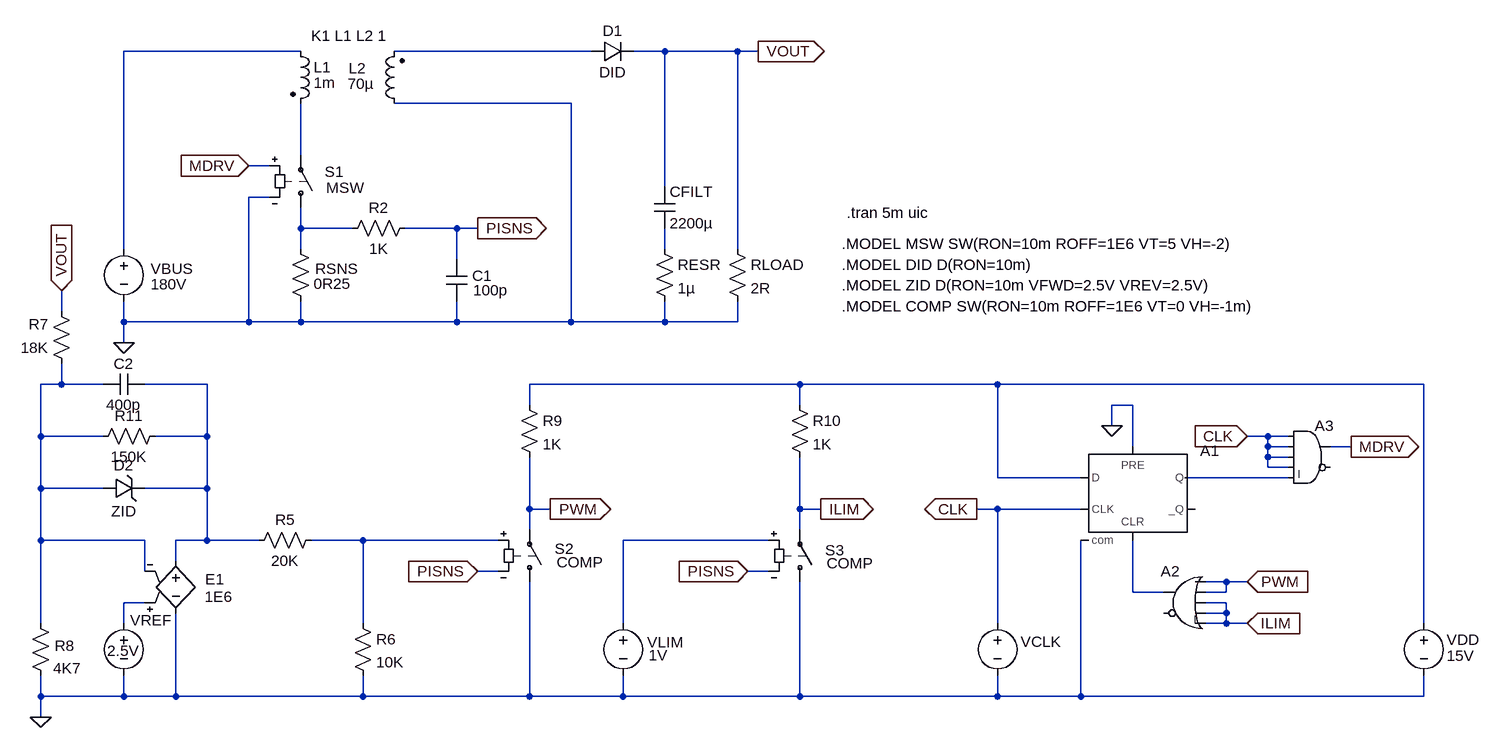
[diagram p0: schematic flyback.asc]
flyback.asc, the LTspice schematic file:
Version 4
SHEET 1 2300 1304
WIRE 368 96 96 96
WIRE 816 96 512 96
WIRE 928 96 880 96
WIRE 1040 96 928 96
WIRE 1072 96 1040 96
WIRE 784 176 512 176
WIRE 368 256 368 176
WIRE 320 272 288 272
WIRE 928 304 928 96
WIRE 320 320 288 320
WIRE 368 368 368 336
WIRE 448 368 368 368
WIRE 608 368 528 368
WIRE 640 368 608 368
WIRE 96 400 96 96
WIRE 368 400 368 368
WIRE 928 400 928 368
WIRE 1040 400 1040 96
WIRE 608 416 608 368
WIRE 0 496 0 464
WIRE 96 512 96 480
WIRE 288 512 288 320
WIRE 288 512 96 512
WIRE 368 512 368 480
WIRE 368 512 288 512
WIRE 608 512 608 480
WIRE 608 512 368 512
WIRE 784 512 784 176
WIRE 784 512 608 512
WIRE 928 512 928 480
WIRE 928 512 784 512
WIRE 1040 512 1040 480
WIRE 1040 512 928 512
WIRE 96 544 96 512
WIRE 0 608 0 576
WIRE 0 608 -32 608
WIRE 64 608 0 608
WIRE 224 608 128 608
WIRE 1136 608 720 608
WIRE 1440 608 1136 608
WIRE 2096 608 1440 608
WIRE 720 640 720 608
WIRE 1136 640 1136 608
WIRE 1648 640 1616 640
WIRE 1616 672 1616 640
WIRE -32 688 -32 608
WIRE 64 688 -32 688
WIRE 224 688 224 608
WIRE 224 688 144 688
WIRE 1856 688 1824 688
WIRE 1888 688 1856 688
WIRE 1648 704 1648 640
WIRE 1856 704 1856 688
WIRE 1888 704 1856 704
WIRE 1984 704 1952 704
WIRE 1856 720 1856 704
WIRE 1888 720 1856 720
WIRE 1856 736 1856 720
WIRE 1888 736 1856 736
WIRE 1440 752 1440 608
WIRE 1568 752 1440 752
WIRE 1888 752 1728 752
WIRE -32 768 -32 688
WIRE 64 768 -32 768
WIRE 224 768 224 688
WIRE 224 768 128 768
WIRE 720 800 720 720
WIRE 752 800 720 800
WIRE 1136 800 1136 720
WIRE 1168 800 1136 800
WIRE 1440 800 1408 800
WIRE 1568 800 1440 800
WIRE 720 832 720 800
WIRE 1136 832 1136 800
WIRE -32 848 -32 768
WIRE 128 848 -32 848
WIRE 224 848 224 768
WIRE 224 848 176 848
WIRE 304 848 224 848
WIRE 464 848 384 848
WIRE 672 848 464 848
WIRE 1088 848 864 848
WIRE 176 880 176 848
WIRE 128 896 128 848
WIRE 672 896 640 896
WIRE 1088 896 1056 896
WIRE 1792 912 1760 912
WIRE 1824 912 1792 912
WIRE 1648 928 1648 848
WIRE 1696 928 1648 928
WIRE 1792 928 1792 912
WIRE 1792 928 1760 928
WIRE 128 944 96 944
WIRE 1792 944 1760 944
WIRE 1792 960 1792 944
WIRE 1792 960 1760 960
WIRE -32 976 -32 848
WIRE 96 976 96 944
WIRE 464 976 464 848
WIRE 864 976 864 848
WIRE 1440 976 1440 800
WIRE 1792 976 1792 960
WIRE 1792 976 1760 976
WIRE 1824 976 1792 976
WIRE 2096 976 2096 608
WIRE -32 1088 -32 1056
WIRE 96 1088 96 1056
WIRE 96 1088 -32 1088
WIRE 176 1088 176 960
WIRE 176 1088 96 1088
WIRE 464 1088 464 1056
WIRE 464 1088 176 1088
WIRE 720 1088 720 912
WIRE 720 1088 464 1088
WIRE 864 1088 864 1056
WIRE 864 1088 720 1088
WIRE 1136 1088 1136 912
WIRE 1136 1088 864 1088
WIRE 1440 1088 1440 1056
WIRE 1440 1088 1136 1088
WIRE 1568 1088 1568 848
WIRE 1568 1088 1440 1088
WIRE 2096 1088 2096 1056
WIRE 2096 1088 1568 1088
WIRE -32 1120 -32 1088
FLAG 640 368 PISNS
IOPIN 640 368 Out
FLAG 288 272 MDRV
IOPIN 288 272 In
FLAG 96 544 0
FLAG -32 1120 0
FLAG 640 896 PISNS
IOPIN 640 896 In
FLAG 1056 896 PISNS
IOPIN 1056 896 In
FLAG 0 464 VOUT
IOPIN 0 464 In
FLAG 1072 96 VOUT
IOPIN 1072 96 Out
FLAG 752 800 PWM
IOPIN 752 800 Out
FLAG 1168 800 ILIM
IOPIN 1168 800 Out
FLAG 1408 800 CLK
IOPIN 1408 800 Out
FLAG 1616 672 0
FLAG 1984 704 MDRV
IOPIN 1984 704 Out
FLAG 1824 912 PWM
IOPIN 1824 912 In
FLAG 1824 976 ILIM
IOPIN 1824 976 In
FLAG 1824 688 CLK
IOPIN 1824 688 In
SYMBOL sw 368 352 M180
WINDOW 0 37 71 Left 0
WINDOW 3 39 46 Left 0
SYMATTR InstName S1
SYMATTR Value MSW
SYMBOL ind2 352 80 R0
WINDOW 3 36 64 Left 0
SYMATTR Value 1m
SYMATTR InstName L1
SYMATTR Type ind
SYMBOL ind2 528 192 R180
WINDOW 0 59 70 Left 0
WINDOW 3 47 46 Left 0
SYMATTR InstName L2
SYMATTR Value 70µ
SYMATTR Type ind
SYMBOL res 352 384 R0
WINDOW 0 38 46 Left 0
WINDOW 3 36 69 Left 0
SYMATTR InstName RSNS
SYMATTR Value 0R25
SYMBOL res 544 352 R90
WINDOW 0 0 56 VBottom 0
WINDOW 3 32 56 VTop 0
SYMATTR InstName R2
SYMATTR Value 1K
SYMBOL cap 592 416 R0
WINDOW 0 40 25 Left 0
WINDOW 3 41 47 Left 0
SYMATTR InstName C1
SYMATTR Value 100p
SYMBOL diode 816 112 R270
WINDOW 0 32 32 VTop 0
WINDOW 3 0 32 VBottom 0
SYMATTR InstName D1
SYMATTR Value DID
SYMBOL cap 912 304 R0
SYMATTR InstName CFILT
SYMATTR Value 2200µ
SYMBOL res 912 384 R0
SYMATTR InstName RESR
SYMATTR Value 1µ
SYMBOL voltage 96 384 R0
WINDOW 0 41 46 Left 0
WINDOW 3 41 70 Left 0
SYMATTR InstName VBUS
SYMATTR Value 180V
SYMBOL res 1024 384 R0
SYMATTR InstName RLOAD
SYMATTR Value 2R
SYMBOL e2 176 864 R0
WINDOW 0 45 44 Left 0
WINDOW 3 44 71 Left 0
SYMATTR InstName E1
SYMATTR Value 1E6
SYMBOL voltage 96 960 R0
WINDOW 0 10 11 Left 0
WINDOW 3 -26 58 Left 0
SYMATTR InstName VREF
SYMATTR Value 2.5V
SYMBOL res 400 832 R90
WINDOW 0 0 56 VBottom 0
WINDOW 3 32 56 VTop 0
SYMATTR InstName R5
SYMATTR Value 20K
SYMBOL res 448 960 R0
SYMATTR InstName R6
SYMATTR Value 10K
SYMBOL sw 720 928 M180
WINDOW 0 39 67 Left 0
WINDOW 3 42 46 Left 0
SYMATTR InstName S2
SYMATTR Value COMP
SYMBOL sw 1136 928 M180
WINDOW 0 39 65 Left 0
WINDOW 3 41 45 Left 0
SYMATTR InstName S3
SYMATTR Value COMP
SYMBOL voltage 864 960 R0
WINDOW 0 37 45 Left 0
WINDOW 3 39 65 Left 0
WINDOW 123 0 0 Left 0
WINDOW 39 0 0 Left 0
SYMATTR InstName VLIM
SYMATTR Value 1V
SYMBOL res 16 592 R180
WINDOW 0 36 76 Left 0
WINDOW 3 36 40 Left 0
SYMATTR InstName R7
SYMATTR Value 18K
SYMBOL res -16 1072 R180
WINDOW 0 -36 62 Left 0
WINDOW 3 -46 27 Left 0
SYMATTR InstName R8
SYMATTR Value 4K7
SYMBOL res 704 624 R0
SYMATTR InstName R9
SYMATTR Value 1K
SYMBOL res 1120 624 R0
SYMATTR InstName R10
SYMATTR Value 1K
SYMBOL Digital\\dflop 1648 704 R0
SYMATTR InstName A1
SYMATTR SpiceLine VHIGH=15 VLOW=0 TRISE=10N TFALL=10N
SYMBOL voltage 1440 960 R0
WINDOW 0 36 44 Left 0
WINDOW 3 36 63 Invisible 0
WINDOW 123 0 0 Left 0
WINDOW 39 0 0 Left 0
SYMATTR InstName VCLK
SYMATTR Value PULSE(0 15 0 10n 10n 9u 10u)
SYMBOL voltage 2096 960 R0
WINDOW 0 35 41 Left 0
WINDOW 3 35 66 Left 0
WINDOW 123 0 0 Left 0
WINDOW 39 0 0 Left 0
SYMATTR InstName VDD
SYMATTR Value 15V
SYMBOL Digital\\or 1728 880 M0
SYMATTR InstName A2
SYMATTR SpiceLine VHIGH=15 VLOW=0 TRISE=10N TFALL=10N
SYMBOL cap 128 592 R90
WINDOW 0 0 32 VBottom 0
WINDOW 3 32 32 VTop 0
SYMATTR InstName C2
SYMATTR Value 400p
SYMBOL Digital\\and 1920 656 R0
SYMATTR InstName A3
SYMATTR SpiceLine VHIGH=15 VLOW=0 TRISE=10N TFALL=10N
SYMBOL zener 64 784 R270
WINDOW 0 36 32 VTop 0
WINDOW 3 -4 32 VBottom 0
SYMATTR InstName D2
SYMATTR Value ZID
SYMBOL res 160 672 R90
WINDOW 0 0 56 VBottom 0
WINDOW 3 32 56 VTop 0
SYMATTR InstName R11
SYMATTR Value 150K
TEXT 384 72 Left 0 !K1 L1 L2 1
TEXT 1208 344 Left 0 !.tran 5m uic
TEXT 1200 392 Left 0 !.MODEL MSW SW(RON=10m ROFF=1E6 VT=5 VH=-2)
TEXT 1200 488 Left 0 !.MODEL COMP SW(RON=10m ROFF=1E6 VT=0 VH=-1m)
TEXT 1200 424 Left 0 !.MODEL DID D(RON=10m)
TEXT 1200 456 Left 0 !.MODEL ZID D(RON=10m VFWD=2.5V VREV=2.5V)

The netlist it stands for:
* flyback.asc
S1 N004 N003 MDRV 0 MSW
L1 N001 N003 1m
L2 0 N002 70µ
RSNS N004 0 0R25
R2 PISNS N004 1K
C1 PISNS 0 100p
D1 N002 VOUT DID
CFILT VOUT N005 2200µ
RESR N005 0 1µ
VBUS N001 0 180V
RLOAD VOUT 0 2R
E1 N007 0 N013 N006 1E6
VREF N013 0 2.5V
R5 N010 N007 20K
R6 N010 0 10K
S2 0 PWM N010 PISNS COMP
S3 0 ILIM N011 PISNS COMP
VLIM N011 0 1V
R7 N006 VOUT 18K
R8 0 N006 4K7
R9 N008 PWM 1K
R10 N008 ILIM 1K
A1 N008 0 CLK 0 N012 0 N009 0 DFLOP VHIGH=15 VLOW=0 TRISE=10N TFALL=10N
VCLK CLK 0 PULSE(0 15 0 10n 10n 9u 10u)
VDD N008 0 15V
A2 PWM PWM ILIM ILIM ILIM 0 N012 0 OR VHIGH=15 VLOW=0 TRISE=10N TFALL=10N
C2 N007 N006 400p
A3 CLK CLK CLK CLK N009 0 MDRV 0 AND VHIGH=15 VLOW=0 TRISE=10N TFALL=10N
D2 N006 N007 ZID
R11 N007 N006 150K
.model D D
.lib standard.dio
K1 L1 L2 1
.tran 5m uic
.MODEL MSW SW(RON=10m ROFF=1E6 VT=5 VH=-2)
.MODEL COMP SW(RON=10m ROFF=1E6 VT=0 VH=-1m)
.MODEL DID D(RON=10m)
.MODEL ZID D(RON=10m VFWD=2.5V VREV=2.5V)
.backanno
.end